# EAGLE design arduino_pir_sensor (EAGLE 6.3)
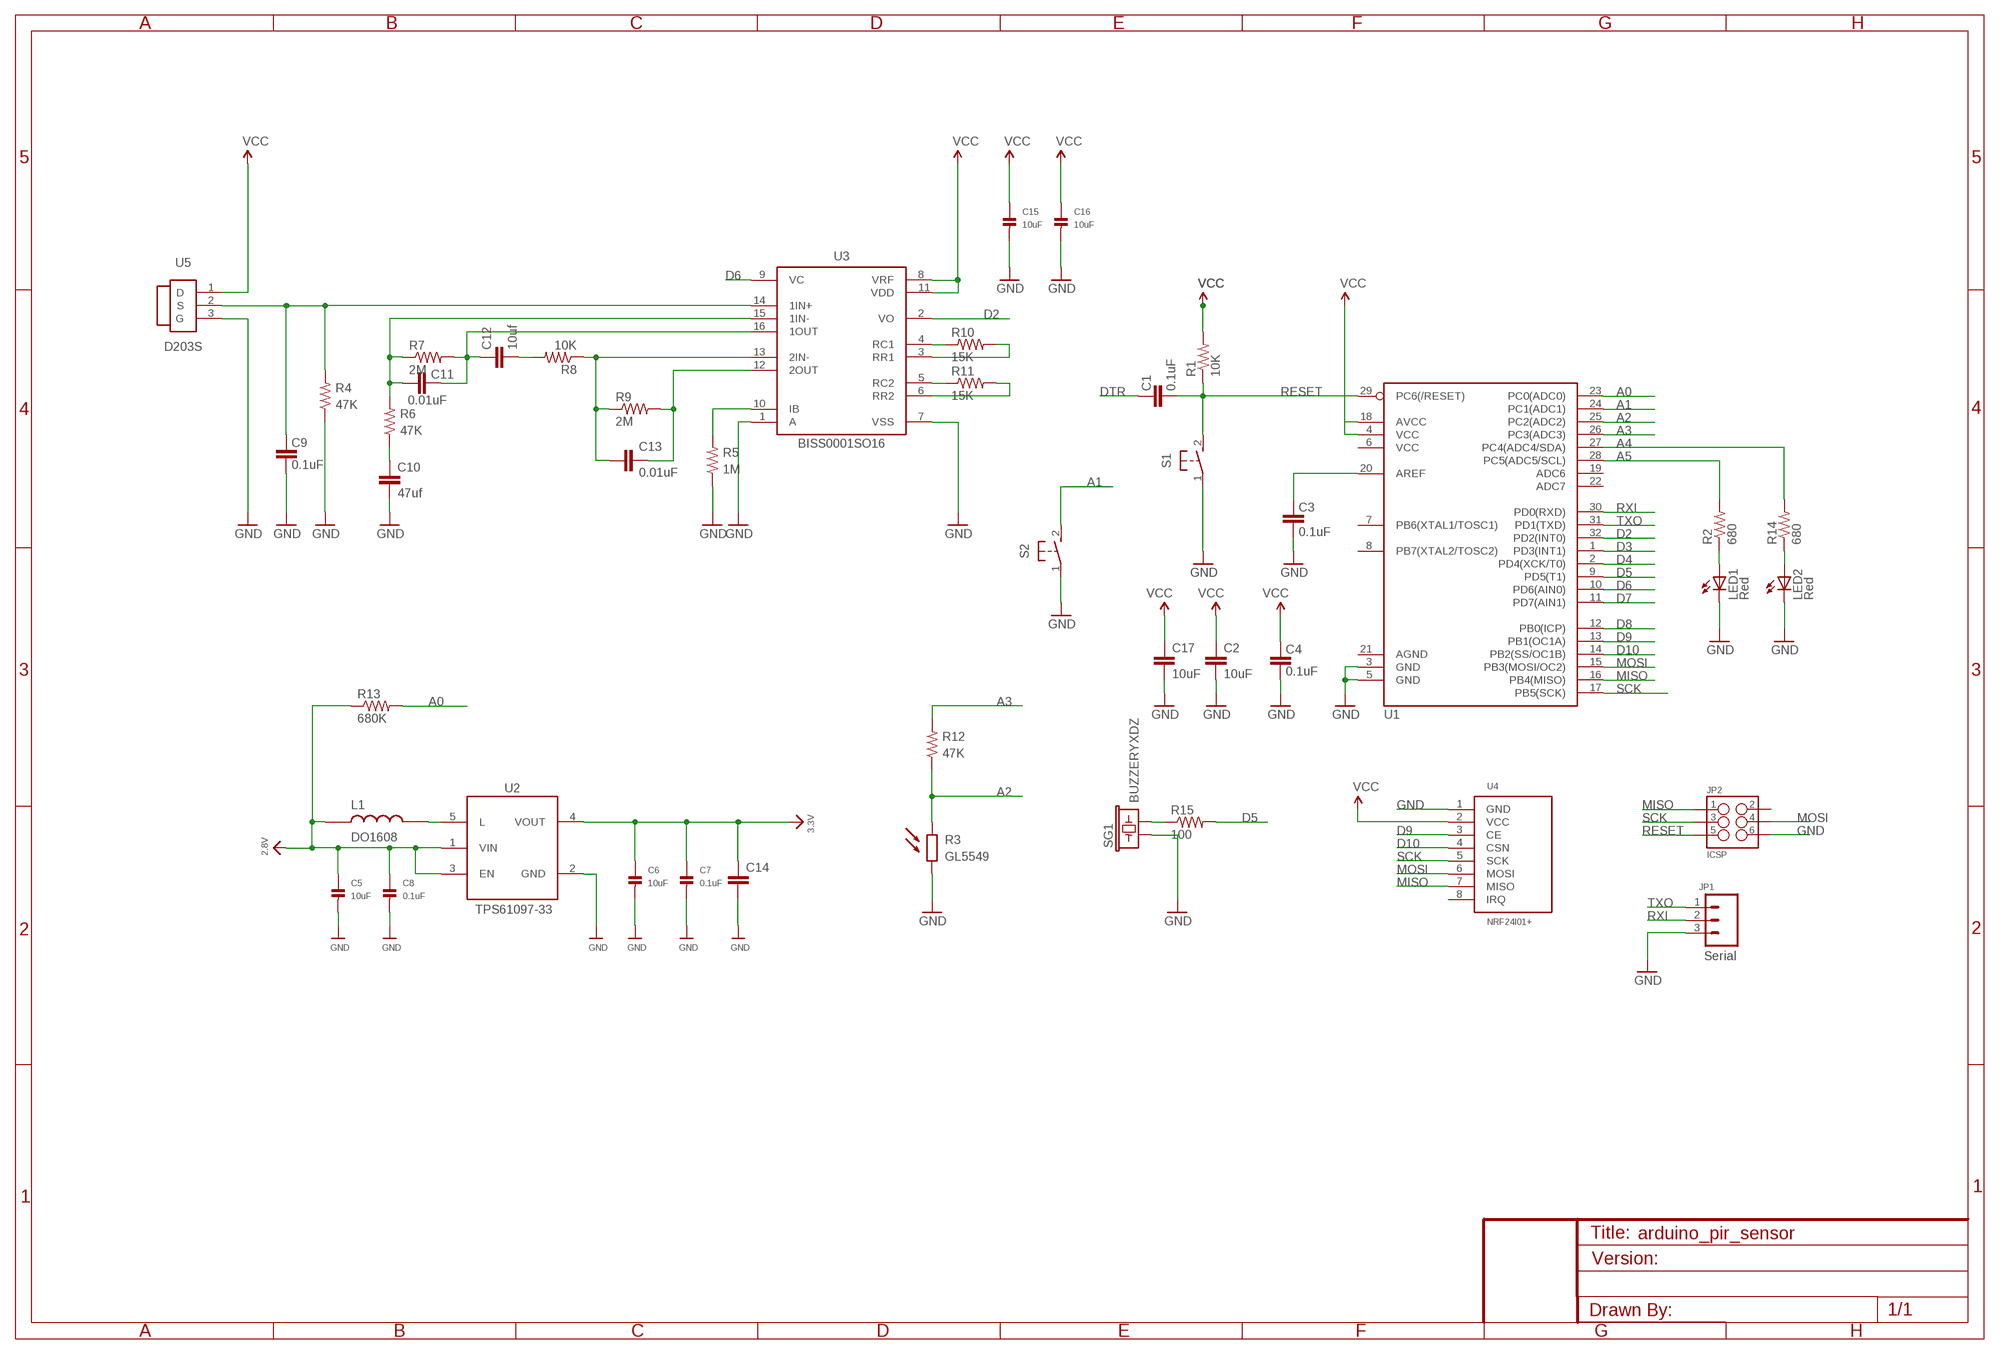
[diagram p0: schematic, sheet 1]

## Parts
C1  0.1uF  CAP0603-CAP  [0603-CAP]
C2  10uF  CAP1206  [1206]
C3  0.1uF  CAP0603-CAP  [0603-CAP]
C4  0.1uF  CAP0603-CAP  [0603-CAP]
C5  10uF  CAP_CERAMIC1206  [1206]
C6  10uF  CAP_CERAMIC1206  [1206]
C7  0.1uF  CAP_CERAMIC0603  [0603]
C8  0.1uF  CAP_CERAMIC0603  [0603]
C9  0.1uF  CAP0603-CAP  [0603-CAP]
C10  47uf  CAP0805  [0805]
C11  0.01uF  CAP0603-CAP  [0603-CAP]
C12  10uf  CAP0805  [0805]
C13  0.01uF  CAP0603-CAP  [0603-CAP]
C14  CAPPTH  [CAP-PTH-SMALL]
C15  10uF  CAP_CERAMIC1206  [1206]
C16  10uF  CAP_CERAMIC1206  [1206]
C17  10uF  CAP1206  [1206]
JP1  Serial  M03PTH  [1X03]
JP2  ICSP  M03X2POGO_PINS  [2X3_POGO]
L1  DO1608  [DO1608]
LED1  Red  LED0603  [LED-0603]
LED2  Red  LED5MM  [LED5MM]
R1  10K  RESISTOR0603-RES  [0603-RES]
R2  680  RESISTOR0603-RES  [0603-RES]
R3  GL5549  [PHOTCELL]
R4  47K  RESISTOR0603-RES  [0603-RES]
R5  1M  RESISTOR0603-RES  [0603-RES]
R6  47K  RESISTOR0603-RES  [0603-RES]
R7  2M  RESISTOR0603-RES  [0603-RES]
R8  10K  RESISTOR0603-RES  [0603-RES]
R9  2M  RESISTOR0603-RES  [0603-RES]
R10  15K  RESISTOR0603-RES  [0603-RES]
R11  15K  RESISTOR0603-RES  [0603-RES]
R12  47K  RESISTOR0603-RES  [0603-RES]
R13  680K  RESISTOR0603-RES  [0603-RES]
R14  680  RESISTOR0603-RES  [0603-RES]
R15  100  RESISTOR0603-RES  [0603-RES]
S1  TAC_SWITCH_SPST-6X3  [TACTILE_SMD_6X3]
S2  TAC_SWITCH_SPST-6X3  [TACTILE_SMD_6X3]
SG1  BUZZERYXDZ  [BUZZER-12MM-7.65]
U1  ATMEGA328_SMT  [TQFP32-08]
U2  TPS61097-33  [SOT-23-5L]
U3  BISS0001SO16  [SO-16]
U4  NRF24L01+_MODULE  [NRF24L01+MODULE]
U5  D203S  [TO5]

## Nets
2.8V: C5.1 C8.1 L1.P$1 R13.1 U2.1(VIN) U2.3(EN)
3.3V: C2.1 C4.2 C6.1 C7.1 C14.1 C15.1 C16.1 C17.1 R1.2 U1.4(VCC) U1.18(AVCC) U2.4(VOUT) U3.8(VRF) U3.11(VDD) U4.2(VCC) U5.1(D) ; supply symbol labelled VCC
A0: R13.2 U1.23(PC0(ADC0))
A1: S2.2 U1.24(PC1(ADC1))
A2: R3.P$1 R12.1 U1.25(PC2(ADC2))
A3: R12.2 U1.26(PC3(ADC3))
A4: R14.2 U1.27(PC4(ADC4/SDA))
A5: R2.2 U1.28(PC5(ADC5/SCL))
D2: U1.32(PD2(INT0)) U3.2(VO)
D3: U1.1(PD3(INT1))
D4: U1.2(PD4(XCK/T0))
D5: R15.2 U1.9(PD5(T1))
D6: U1.10(PD6(AIN0)) U3.9(VC)
D7: U1.11(PD7(AIN1))
D8: U1.12(PB0(ICP))
D9: U1.13(PB1(OC1A)) U4.3(CE)
D10: U1.14(PB2(SS/OC1B)) U4.4(CSN)
DTR: C1.2
GND [vcc]: C2.2 C3.1 C4.1 C5.2 C6.2 C7.2 C8.2 C9.1 C10.2 C14.2 C15.2 C16.2 C17.2 JP1.3 JP2.P$6 LED1.C LED2.K(C) R3.P$2 R4.1 R5.1 S1.1 S2.1 SG1.- U1.3(GND) U1.5(GND) U2.2(GND) U3.1(A) U3.7(VSS) U4.1(GND) U5.3(G)
MISO: JP2.P$1 U1.16(PB4(MISO)) U4.7(MISO)
MOSI: JP2.P$4 U1.15(PB3(MOSI/OC2)) U4.6(MOSI)
N$1: L1.P$2 U2.5(L)
N$2: C9.2 R4.2 U3.14(1IN+) U5.2(S)
N$3: LED1.A R2.1
N$4: C3.2 U1.20(AREF)
N$5: R5.2 U3.10(IB)
N$6: C10.1 R6.1
N$7: C11.2 R6.2 R7.1 U3.15(1IN-)
N$8: C11.1 C12.1 R7.2 U3.16(1OUT)
N$9: C12.2 R8.2
N$10: C13.1 R8.1 R9.1 U3.13(2IN-)
N$11: C13.2 R9.2 U3.12(2OUT)
N$12: R11.1 U3.5(RC2)
N$13: R10.1 U3.4(RC1)
N$14: R10.2 U3.3(RR1)
N$15: R11.2 U3.6(RR2)
N$16: R15.1 SG1.+
N$17: LED2.A R14.1
RESET: C1.1 JP2.P$5 R1.1 S1.2 U1.29(PC6(/RESET))
RXI: JP1.2 U1.30(PD0(RXD))
SCK: JP2.P$3 U1.17(PB5(SCK)) U4.5(SCK)
TXO: JP1.1 U1.31(PD1(TXD))
Unconnected: JP2.P$2 U1.6(VCC) U1.7(PB6(XTAL1/TOSC1)) U1.8(PB7(XTAL2/TOSC2)) U1.19(ADC6) U1.21(AGND) U1.22(ADC7) U4.8(IRQ)

## Library data of the parts
C1 C3 C4 C9 = SparkFun-Capacitors:CAP: Capacitor Standard 0603 ceramic capacitor, and 0.1" leaded capacitor.; MPN: 02016D104KAT2A; OC_NEWARK: 89W0551
C2 C10-C13 C17 = SparkFun-Capacitors:CAP: Capacitor Standard 0603 ceramic capacitor, and 0.1" leaded capacitor.; OC_NEWARK: unknown
C5-C8 C15 C16 = microbuilder:CAP_CERAMIC: Ceramic Capacitors 0402 - 0402 Surface Mount Capacitors 16pF 50V 5% [Digikey: 445-4899-2-ND] 18pF 50V 5% [Digikey: 490-1281-2-ND] 22pF 50V 5% [Digikey: 490-1283-2-ND] 68pF 50V 5% [Digikey: 490-1289-2-ND] 0.1uF 10V 10% [Digikey: 490-1318-2-ND] 1.0uF 6.3V 10% [Digikey: 490-1320-2-ND] 0603 - 0603 Surface Mount Capacitors 16 pF 50V 5% [Digikey: 445-5051-2-ND] 22 pF 50V [Digikey: PCC220ACVTR-ND] 33 pF 50V 5% [Digikey: 490-1415-1-ND] 56pF 50V 5% [Digikey: 490-1421-1-ND] 220pF 50V 5% [Digikey: 445-1285-1-ND] 680 pF 50V 2200 pF 50V 5% C0G [Digikey: 445-1297-1-ND] 5600 pF 100V 5% X7R [Digikey: 478-3711-1-ND] 0.1 µF 25V 10% [Digikey: PCC2277TR-ND] 0.22 µF 16V 10% X7R [Digikey: 445-1318-1-ND] 1.0 µF 25V 10% [Digikey: 445-5146-2-ND] 0603 - RF Specific 3pF 250V +/-0.1pF RF [Digikey: 712-1347-1-ND] 18 pF 250V 5% [Digikey: 478-3505-1-ND or 712-1322-1-ND] 56 pF 250V 5% C0G RF [Digikey: 490-4867-1-ND] 68 pF 250V RF [Digikey: 490-4868-1-ND] 0805 - 0805 Surface Mount Capacitors 220 pF 250V 2% RF Ceramic Capacitor [Digikey: 712-1398-1-ND] 1000 pF 50V 2% NP0 Ceramic Capacitor [Digikey: 478-3760-1-ND] 0.1 µF 25V 10% Ceramic Capacitor [Digikey: PCC1828TR-ND] 1.0 µF 16V 10% Ceramic Capacitor[Digikey: 490-1691-2-ND] 10.0 µF 10V 10% Ceramic Capacitor[Digikey: 709-1228-1-ND] 10.0 uF 16V 10% Ceramic Capacitor [Digikey: 478-5165-2-ND] 47 uF 6.3V 20% Ceramic Capacitor [Digikey: 587-1779-1-ND or 399-5506-1-ND] 1206 - 1206 Surface Mount Capacitors 47uF 10V 20% Ceramic Capacitor [Digikey: 490-5528-1-ND or 399-5508-1-ND or 445-6010-1-ND] 100uF 6.3V -20%, +80% Y5V Ceramic Capacitor (Digikey: 490-4512-1-ND, Mouser: 81-GRM31CF50J107ZE1L); OC_NEWARK: unknown
C14 = SparkFun-Capacitors:CAP: Capacitor Standard 0603 ceramic capacitor, and 0.1" leaded capacitor.
JP1 = endy-connectors:M03: Header 3 Standard 3-pin 0.1" header. Use with straight break away headers (SKU : PRT-00116), right angle break away headers (PRT-00553), swiss pins (PRT-00743), machine pins (PRT-00117), and female headers (PRT-00115). Molex polarized connector foot print use with SKU : PRT-08232 with associated crimp pins and housings.
JP2 = endy-connectors:M03X2: 2x3 .1" header. Shrouded, with keying- CONN-10681 SMT- CONN-11415 Pogo pins- HW-11044; OC_NEWARK: unknown; PROD_ID: HW-11044
L1 = inductors:DO1608: SMD power inductor; OC_NEWARK: unknown
LED1 = SparkFun-LED:LED: LEDs Standard schematic elements and footprints for 5mm, 3mm, 1206, and 0603 sized LEDs. 5mm - Spark Fun Electronics SKU : COM-00529 (and others); OC_NEWARK: unknown
LED2 = led:LED: LED OSRAM: - CHIPLED LG R971, LG N971, LY N971, LG Q971, LY Q971, LO R971, LY R971 LH N974, LH R974 LS Q976, LO Q976, LY Q976 LO Q996 - Hyper CHIPLED LW Q18S LB Q993, LB Q99A, LB R99A - SideLED LS A670, LO A670, LY A670, LG A670, LP A670 LB A673, LV A673, LT A673, LW A673 LH A674 LY A675 LS A676, LA A676, LO A676, LY A676, LW A676 LS A679, LY A679, LG A679 - Hyper Micro SIDELED® LS Y876, LA Y876, LO Y876, LY Y876 LT Y87S - SmartLED LW L88C, LW L88S LB L89C, LB L89S, LG L890 LS L89K, LO L89K, LY L89K LS L896, LA L896, LO L896, LY L896 - TOPLED LS T670, LO T670, LY T670, LG T670, LP T670 LSG T670, LSP T670, LSY T670, LOP T670, LYG T670 LG T671, LOG T671, LSG T671 LB T673, LV T673, LT T673, LW T673 LH T674 LS T676, LA T676, LO T676, LY T676, LB T676, LH T676, LSB T676, LW T676 LB T67C, LV T67C, LT T67C, LS T67K, LO T67K, LY T67K, LW E67C LS E67B, LA E67B, LO E67B, LY E67B, LB E67C, LV E67C, LT E67C LW T67C LS T679, LY T679, LG T679 LS T770, LO T770, LY T770, LG T770, LP T770 LB T773, LV T773, LT T773, LW T773 LH T774 LS E675, LA E675, LY E675, LS T675 LS T776, LA T776, LO T776, LY T776, LB T776 LHGB T686 LT T68C, LB T68C - Hyper Mini TOPLED® LB M676 - Mini TOPLED Santana® LG M470 LS M47K, LO M47K, LY M47K Source: http://www.osram.convergy.de LUXEON: - LUMILED® LXK2-PW12-R00, LXK2-PW12-S00, LXK2-PW14-U00, LXK2-PW14-V00 LXK2-PM12-R00, LXK2-PM12-S00, LXK2-PM14-U00 LXK2-PE12-Q00, LXK2-PE12-R00, LXK2-PE12-S00, LXK2-PE14-T00, LXK2-PE14-U00 LXK2-PB12-K00, LXK2-PB12-L00, LXK2-PB12-M00, LXK2-PB14-N00, LXK2-PB14-P00, LXK2-PB14-Q00 LXK2-PR12-L00, LXK2-PR12-M00, LXK2-PR14-Q00, LXK2-PR14-R00 LXK2-PD12-Q00, LXK2-PD12-R00, LXK2-PD12-S00 LXK2-PH12-R00, LXK2-PH12-S00 LXK2-PL12-P00, LXK2-PL12-Q00, LXK2-PL12-R00 Source: www.luxeon.com KINGBRIGHT: KA-3528ASYC Source: www.kingbright.com; OC_NEWARK: unknown
R1 R2 R4-R15 = SparkFun-Resistors:RESISTOR: Resistor Basic schematic elements and footprints for 0603, 1206, and PTH resistors.; OC_NEWARK: unknown
R3 = opto:GL5549: Cds PHOTOCONDUCTIOVE CELL; OC_NEWARK: unknown
S1 S2 = buttons:TAC_SWITCH_SPST; OC_NEWARK: unknown
SG1 = endy-electromechanical:BUZZER: Buzzer 12mm Spark Fun Electronics SKU : Comp-Buzzer; OC_NEWARK: unknown
U1 = SparkFun-DigitalIC:ATMEGA328_SMT: 32-Pin Atmega328 part Commonly used on Arduino compatible boards Available in QFP and QFN packages TQFP is IC-09069 QFN is non-stock; OC_NEWARK: unknown; PROD_ID: IC-09069; VALUE: ATMEGA328P
U2 = DC-DC:TPS61097-33: Description The TPS61097 provide a power supply solution for products powered by either a single-cell, two-cell, or three-cell alkaline, NiCd, or NiMH, or one-cell Li-Ion or Li-polymer battery. They can also be used in fuel cell or solar cell powered devices where the capability of handling low input voltages is essential. Possible output currents depend on the input-to-output voltage ratio. The devices provides output currents up to 100 mA at a 3.3-V output while using a single-cell Li-Ion or Li-Polymer battery. The boost converter is based on a current-mode controller using synchronous rectification to obtain maximum efficiency. The maximum average input current is limited to a value of 350 mA. The output voltage can be programmed by an external resistor divider, or it is fixed internally on the chip. The converter can be disabled to minimize battery drain. During shutdown, the battery is connected to the load to enable battery backup of critical functions on the load. The fixed output device is packaged in a 5-pin SOT-23 package (DBV) measuring 2.8 mm × 2.9 mm. Features Up to 95% Efficiency at Typical Operating Conditions Connection from Battery to Load via Bypass Switch in Shutdown Mode Typical Shutdown Current Less Than 5 nA Typical Quiescent Current Less Than 5 µA Operating Input Voltage Range From 0.9 V to 5.5 V Power-Save Mode for Improved Efficiency at Low Output Power Overtemperature Protection Small 2.8-mm × 2.9-mm 5-Pin SOT-23 Package (6-Pin for Adjustable) Applications MSP430 Applications All Single-Cell, Two-Cell, and Three-Cell Alkaline, NiCd, NiMH, or Single-Cell Li-Battery Powered Products Personal Medical Products Fuel Cell and Solar Cell Powered Products PDAs Mobile Applications White LEDs Source http://www.ti.com/lit/ds/symlink/tps61040.pdf; OC_NEWARK: unknown
U3 = ic:BISS0001: Features Low power CMOS technology (ideal for battery operated PIR devices) CMOS high input impedance operational amplifiers Bi-directional level detector / Excellent noise immunity Built-in Power up disable & output pulse control logic Dual mode : retriggerable & non-retriggerable Source Datasheet <http://learn.adafruit.com/system/assets/assets/000/010/133/original/BISS0001.pdf>; OC_NEWARK: unknown
U4 = modules:NRF24L01+_MODULE
U5 = opto:D203S: The pyroelectric infrared sensor The pyroelectric infrared sensor detects infrared radiation on the basis of the characteristics that the polarization of pyroelectric material changes with temperature. Dual compensated sensing elements are applied to suppress the interference resulting from temperature variation. As a result, the operating stability of the sensor is greatly improved. Our products can be used in many applications. Such as in security systems, burglar alarms, visitor acknowledgement, light switch control and intellectualized toy, etc.; OC_NEWARK: unknown

## Net classes
1 vcc: width 0.254 mm

## Board
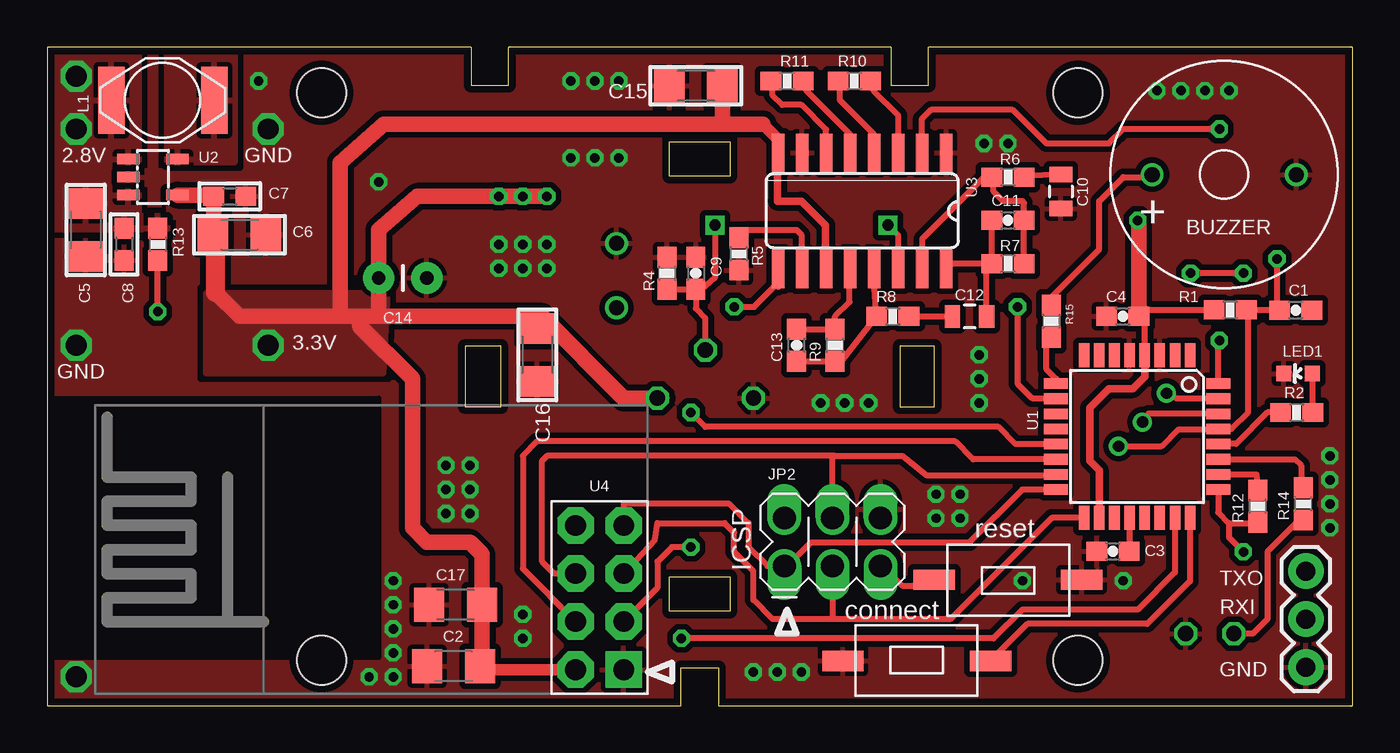
[diagram p1: board, top side]
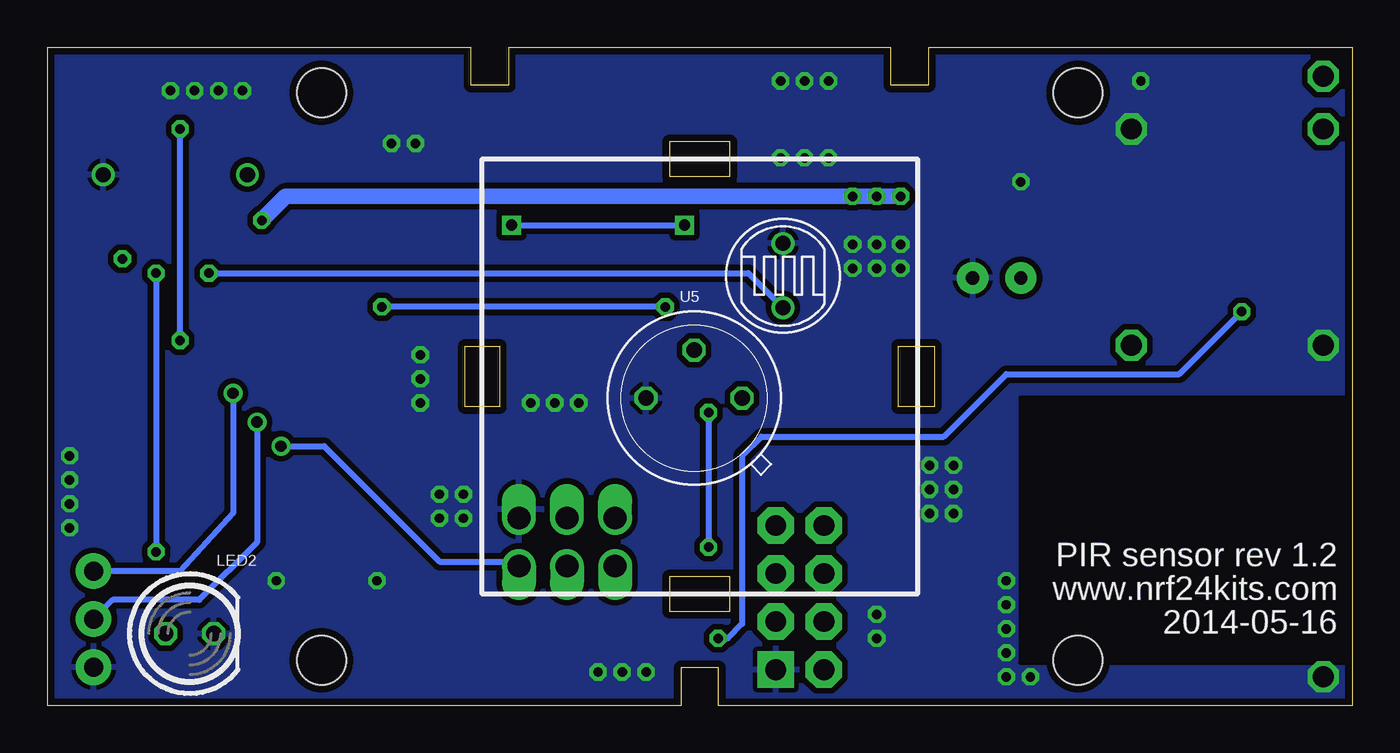
[diagram p2: board, bottom side, seen from below]

Size 69 x 34.8 mm. Coordinates in mm from the lower left corner, seen from the top.
Outline: 0,0 33.5,0 33.5,2 35.5,2 35.5,0 69,0 69,34.8 46.6,34.8 46.6,32.8 44.6,32.8 44.6,34.8 24.4,34.8 24.4,32.8 22.4,32.8 22.4,34.8 0,34.8 0,0
Outline: 32.9,4.98 32.9,6.82 36.1,6.82 36.1,4.98 32.9,4.98
Outline: 32.9,27.98 32.9,29.82 36.1,29.82 36.1,27.98 32.9,27.98
Outline: 22.08,15.8 24,15.8 24,19 22.08,19 22.08,15.8
Outline: 45.08,15.8 46.92,15.8 46.92,19 45.08,19 45.08,15.8
Copper layers (1*16): Top 0.035mm / dielectric 1.5mm / Bottom 0.035mm
Design rules "default *": minimum track width 10mil, minimum drill 10mil, track to track 12mil, track to pad 10mil, pad to pad 6mil, via to via 6mil, smd to smd 6mil, copper to edge 15mil, drill to drill 8mil, minimum pad ring 8mil, minimum via ring 8mil, stop-mask expansion 4mil, vias tented up to drill 20mil, thermal gap 10mil
Holes 2.6 mm at 14.5,2.4 14.5,32.4 54.5,2.4 54.5,32.4
tRestrict: area 0,2.5 to 17.5,16.3
bRestrict: area 0,2.3 to 17.5,16.3

### Footprints (pad centres in the part's own frame; a part is rotated, then mirrored left to right if it is on the bottom)
0603-CAP = smd 1.1 x 1: 1 -0.85,0; 2 0.85,0
1206 = smd 1.6 x 1.8: 1 -1.4,0; 2 1.4,0
0603 = smd 1.1 x 1: 1 -0.85,0; 2 0.85,0
0805 = smd 0.8 x 1.2: 1 -0.9,0; 2 0.9,0
CAP-PTH-SMALL = drill 0.7 pad 1.651: 1 0,0; 2 2.54,0
1X03 = drill 1.016 pad 1.88: 1 0,0; 2 2.54,0; 3 5.08,0
2X3_POGO = drill 1.2 pad 1.575 offset: P$1 0,0; P$2 0,2.54; P$3 2.54,0; P$4 2.54,2.54; P$5 5.08,0; P$6 5.08,2.54
DO1608 = smd 1.4 x 3.56: P$1 -2.71,0; P$2 2.74,0
LED-0603 = smd 0.8 x 0.8: A 0,-0.75; C 0,0.75
LED5MM = drill 0.813 octagon: A -1.27,0; K 1.27,0
0603-RES = smd 1.1 x 1: 1 -0.85,0; 2 0.85,0
PHOTCELL = drill 0.8: P$1 0,-1.7; P$2 0,1.7
TACTILE_SMD_6X3 = smd 2.184 x 1.067: 1 -3.9,-0.05; 2 3.9,-0.05
BUZZER-12MM-7.65 = drill 0.8: + 3.81,0; - -3.81,0
TQFP32-08 = smd 1.27 x 0.559: 1 -4.293,2.8; 2 -4.293,2; 3 -4.293,1.2; 4 -4.293,0.4; 5 -4.293,-0.4; 6 -4.293,-1.2; 7 -4.293,-2; 8 -4.293,-2.8; 17 4.293,-2.8; 18 4.293,-2; 19 4.293,-1.2; 20 4.293,-0.4; 21 4.293,0.4; 22 4.293,1.2; 23 4.293,2; 24 4.293,2.8 | smd 0.559 x 1.27: 9 -2.8,-4.293; 10 -2,-4.293; 11 -1.2,-4.293; 12 -0.4,-4.293; 13 0.4,-4.293; 14 1.2,-4.293; 15 2,-4.293; 16 2.8,-4.293; 25 2.8,4.293; 26 2,4.293; 27 1.2,4.293; 28 0.4,4.293; 29 -0.4,4.293; 30 -1.2,4.293; 31 -2,4.293; 32 -2.8,4.293
SOT-23-5L = smd 0.55 x 1.2: 1 -0.95,-1.3; 2 0,-1.3; 3 0.95,-1.3; 4 0.95,1.3; 5 -0.95,1.3
SO-16 = smd 0.66 x 2.032: 1 -4.445,-3.073; 2 -3.175,-3.073; 3 -1.905,-3.073; 4 -0.635,-3.073; 5 0.635,-3.073; 6 1.905,-3.073; 7 3.175,-3.073; 8 4.445,-3.073; 9 4.445,3.073; 10 3.175,3.073; 11 1.905,3.073; 12 0.635,3.073; 13 -0.635,3.073; 14 -1.905,3.073; 15 -3.175,3.073; 16 -4.445,3.073
NRF24L01+MODULE = drill 1.1 pad 1.93 square: 1 -1.27,3.81 | drill 1.1 pad 1.93 octagon: 2 1.27,3.81; 3 -1.27,1.27; 4 1.27,1.27; 5 -1.27,-1.27; 6 1.27,-1.27; 7 -1.27,-3.81; 8 1.27,-3.81
TO5 = drill 0.813 octagon: 1 0,-2.54; 2 2.54,0; 3 0,2.54

### Placement (x,y rotation side)
C1  66.01,20.91 0 top
C2  21.48,2.08 180 top
C3  56.35,8.16 0 top
C4  56.86,20.58 0 top
C5  2.03,25.15 270 top
C6  10.16,24.89 0 top
C7  9.65,26.92 0 top
C8  4.06,24.38 270 top
C9  34.29,22.86 270 top
C10  53.59,27.18 270 top
C11  50.8,25.65 0 top
C12  48.77,20.57 180 top
C13  39.62,19.05 90 top
C14  17.53,22.61 0 top
C15  34.29,32.77 180 top
C16  25.91,18.54 270 top
C17  21.59,5.33 180 top
JP1  66.55,7.11 270 top
JP2  38.98,7.39 0 top
L1  6.1,32 0 top
LED1  66.14,17.56 90 top
LED2  61.47,3.81 0 bottom
R1  62.55,20.92 180 top
R2  66.06,15.5 180 top
R3  30.1,22.73 0 bottom
R4  32.77,22.86 270 top
R5  36.58,23.88 90 top
R6  50.8,27.94 180 top
R7  50.8,23.37 180 top
R8  44.7,20.57 0 top
R9  41.66,19.05 90 top
R10  42.67,33.02 0 top
R11  39.12,33.02 180 top
R12  64.01,10.54 90 top
R13  5.84,24.38 270 top
R14  66.42,10.67 90 top
R15  53.09,20.32 270 top
S1  50.8,6.6 180 top
S2  45.97,2.41 0 top
SG1  62.23,28.07 180 top
U1  57.62,14.22 270 top
U2  5.59,27.94 270 top
U3  43.09,26.15 180 top
U4  29.21,5.71 180 top
U5  34.8,16.26 90 bottom

### Tracks (layer width: path | path; a pad name or v marks a point on that pad's centre or on a via)
2.8V  (via drill 1.1)
  Top 0.305: 4.35,28.96 U2.1
  other vias: 1.52,33.27 1.52,30.48
  pour Top: 0,34.8 4.83,34.8 4.83,28.7 3.3,28.7 3.3,27.18 4.83,27.18 4.83,25.91 6.35,25.91 6.35,25.15 0,25.15
3.3V  (via drill 0.5, 1.1)
  Top 0.305: U1.4 58.02,20.92 | C4.2 58.02,21.08 58.02,20.92 | 58.02,20.92 R1.2 | 8.89,25.02 C6.1 | U3.8 38.65,29.93 | 57.71,25.6 v57.66,25.65 | U5.1 32.77,16.26 | C16.1 25.91,20.57
  Top 0.406: U1.18 55.63,12.45 55.12,12.95 55.12,15.75 56.13,16.76 57.4,16.76 58.04,17.4 58.04,18.53 U1.4 | U3.8 38.61,29.23 38.61,26.67 39.88,26.67 41.15,25.4 41.15,23.12 U3.11
  Top 0.61: 38.65,29.93 37.85,30.73 | C2.1 23.06,1.91 U4.2 23.5,1.91 23.11,2.29
  Top 0.813: U5.1 30.48,16.26 26.16,20.57 25.91,20.57 17.53,20.57 | 17.53,20.57 17.27,20.57 | 16.51,20.57 17.27,20.57 | 37.85,30.73 35.56,30.73 | C4.2 57.71,25.6 | U2.4 8.74,26.99 C7.1 8.8,25.1 C6.1 | v26.42,26.92 v23.88,26.92 19.56,26.92 17.53,25.15 17.53,20.57 | 35.56,30.73 17.78,30.73 15.49,28.7 15.49,20.57 | 16.51,20.57 15.49,20.57 | C14.1 17.53,20.83 17.27,20.57 | 8.89,21.84 10.16,20.57 15.49,20.57 | C15.1 35.69,30.86 35.56,30.73 | 16.51,20.57 16.51,20.07 19.3,17.27 19.3,9.4 20.07,8.64 22.35,8.64 22.99,8 C17.1 22.99,2.19 C2.1
  Top 1.016: 8.89,25.02 8.89,21.84
  Bottom 0.813: v23.88,26.92 v25.15,26.92 56.39,26.92 v57.66,25.65
  other vias: 11.68,19.05
  pour Top: 8.38,21.84 18.03,21.84 17.78,17.53 8.38,17.53
A0  (via drill 0.5)
  Top 0.305: v5.84,20.83 R13.2 | U1.23 59.62,7.04 57.66,5.08 51.56,5.08 50.04,3.56 v33.53,3.56
  Bottom 0.305: v33.53,3.56 33.02,3.56 32.26,4.32 32.26,13.21 31.24,14.22 21.59,14.22 18.29,17.53 9.14,17.53 v5.84,20.83
A1
  Top 0.305: U1.24 60.42,6.58 58.17,4.32 51.83,4.32 S2.2
A2  (via drill 0.5)
  Top 0.305: v63.25,22.86 v60.45,22.86 | U1.25 61.92,10.22 62.48,9.65 | 62.48,9.65 63.97,9.65 R12.1 | 62.48,9.65 62.48,8.89 v63.25,8.13
  Bottom 0.305: v63.25,22.86 v63.25,8.13 | v60.45,22.86 31.93,22.86 R3.P$1
A3
  Top 0.305: U1.26 63.94,12.22 R12.2
A4
  Top 0.305: U1.27 65.97,13.03 66.29,12.7 66.29,11.64 R14.2
A5
  Top 0.305: R2.2 64.52,15.5 62.87,13.84 61.93,13.84 U1.28
D2  (via drill 0.5)
  Top 0.305: U1.32 61.92,19.24 v61.98,19.3 | v61.98,30.48 56.9,30.48 56.13,29.72 52.83,29.72 51.05,31.5 46.74,31.5 46.23,30.99 46.23,29.26 U3.2
  Bottom 0.305: v61.98,19.3 v61.98,30.48
D5
  Top 0.305: U1.9 53.33,17.28 52.83,17.78 52.83,19.22 R15.2
D6  (via drill 0.5)
  Top 0.305: U3.9 38.65,22.35 | 38.65,22.35 38.65,22.14 | v51.31,21.08 51.31,17.02 52.07,16.26 53.3,16.26 U1.10 | v36.32,21.08 37.38,21.08 38.65,22.35
  Bottom 0.305: v36.32,21.08 v51.31,21.08
D9  (via drill 0.5)
  Top 0.305: U1.13 51.2,13.82 50.29,14.73 34.8,14.73 v34.04,15.49 | v34.04,8.38 33.02,8.38 32.26,7.62 32.26,6.22 U4.3
  Bottom 0.305: v34.04,15.49 v34.04,8.38
D10
  Top 0.305: U1.14 48.95,13.03 48.01,13.97 25.91,13.97 25.15,13.21 25.15,7.24 U4.4
GND  (via drill 0.5, 1.1)
  other vias: 11.18,33.02 27.69,28.96 28.96,28.96 30.23,28.96 49.53,29.72 17.53,27.69 40.89,16 21.08,12.7 21.08,11.43 22.35,11.43 22.35,12.7 21.08,10.16 22.35,10.16 39.88,1.78 38.61,1.78 37.34,1.78 25.15,3.56 25.15,4.83 58.67,32.51 59.94,32.51 61.21,32.51 62.48,32.51 27.69,33.02 28.96,33.02 30.23,33.02 67.82,10.67 56.9,6.6 46.99,11.18 48.26,11.18 48.26,9.91 46.99,9.91 49.28,18.54 49.28,17.27 49.28,16 18.29,1.52 17.02,1.52 18.29,6.6 18.29,4.06 18.29,2.79 1.52,1.52 51.56,6.6 23.88,24.38 25.15,24.38 26.42,24.38 26.42,23.11 25.15,23.11 23.88,23.11 43.43,16 42.16,16 50.8,29.72 18.29,5.33 67.82,11.94 67.82,13.21 67.82,9.4 1.52,19.05 11.68,30.48
  pour Top (rank 6): 0,34.8 68.83,34.8 68.83,0 0,0
  pour Bottom: 0,34.8 69.09,34.8 69.09,0 0,0
MISO
  Top 0.305: 53.34,11.41 U1.16 51.56,11.43 48.77,8.64 40.39,8.64 39.14,7.39 JP2.P$1 38.08,7.39 37.08,8.38 37.08,9.65 36.07,10.67 30.48,10.67 U4.7
MOSI
  Top 0.305: JP2.P$4 41.52,13.07 41.66,13.21 | U1.15 53.3,12.19 46.48,12.19 45.21,13.21 41.66,13.21 | 41.66,13.21 26.42,13.21 26.16,12.95 26.16,7.62 26.8,6.99 U4.6
N$1
  pour Top: 6.35,34.8 9.91,34.8 9.91,28.7 6.35,28.7
N$2  (via drill 0.6)
  Top 0.305: U5.2 34.8,20.49 34.29,20.99 C9.2 R4.2 34.63,22.01 35.31,22.61 v35.31,25.4 | U3.14 44.99,24.86 v44.45,25.4
  Bottom 0.305: v44.45,25.4 v35.31,25.4
N$3
  Top 0.305: LED1.A 66.89,15.52 R2.1
N$4
  Top 0.305: U1.20 57.22,7.97 C3.2
N$5
  Top 0.305: R5.2 36.66,24.73 37.08,25.15 39.62,25.15 39.88,24.89 39.88,23.12 U3.10
N$6
  Top 0.305: C10.1 51.7,27.99 R6.1
N$7
  Top 0.305: U3.15 46.27,24.68 49.53,27.94 R6.2 50.04,27.85 50.04,27.18 50.55,26.67 51.56,26.67 51.65,26.58 C11.2 R7.1
N$8
  Top 0.305: R7.2 C11.1 | C12.1 49.67,23.09 R7.2 | R7.2 47.82,23.37 U3.16
N$9
  Top 0.305: R8.2 C12.2
N$10
  Top 0.305: C13.1 R9.1 41.99,18.2 R8.1 43.69,22.79 U3.13
N$11
  Top 0.305: C13.2 R9.2 41.66,20.57 42.42,21.34 42.42,22.79 U3.12
N$12
  Top 0.305: U3.5 42.45,30.19 40.13,32.51 40.13,32.93 R11.1
N$13
  Top 0.305: 42.16,32.68 R10.1 41.91,32.93 41.91,32 43.69,30.23 43.69,29.01 U3.4
N$14
  Top 0.305: U3.3 44.99,31.2 43.69,32.51 43.69,32.85 R10.2
N$15
  Top 0.305: U3.6 41.19,30.44 39.88,31.75 38.86,31.75 38.35,32.26 38.35,32.85 R11.2
N$16
  Top 0.305: R15.1 53.09,21.59 55.63,24.13 55.63,26.67 56.9,27.94 58.29,27.94 SG1.+
N$17
  Top 0.305: R14.1 66.21,9.82 64.52,8.13 64.52,4.57 63.75,3.81 LED2.A
RESET  (via drill 0.5, 0.6)
  Top 0.305: C1.1 R1.1 63.5,20.82 63.5,15.49 62.63,14.62 U1.29 61.9,14.61 59.82,14.61 58.93,13.72 v56.64,13.72 | 65.28,20.79 C1.1 | JP2.P$5 44.18,7.39 45.21,6.35 46.6,6.35 S1.2 | v65.02,23.62 65.02,21.04 C1.1
  Bottom 0.305: v56.64,13.72 54.36,13.72 48.26,7.62 44.29,7.62 JP2.P$5
RXI  (via drill 0.6)
  Top 0.305: U1.30 58.23,15.44 v57.91,14.99
  Bottom 0.305: v57.91,14.99 57.91,8.64 60.96,5.59 65.53,5.59 JP1.2
SCK
  Top 0.305: 54.86,9.89 U1.17 53.11,9.93 47.75,4.57 41.4,4.57 | U4.5 32.13,8.76 32.26,9.65 35.81,9.65 36.32,9.14 36.32,8.13 37.34,7.11 37.34,5.59 38.35,4.57 41.4,4.57 | JP2.P$3 41.52,4.69 41.4,4.57
TXO  (via drill 0.6)
  Top 0.305: U1.31 59.72,16.23 v59.18,16.51
  Bottom 0.305: v59.18,16.51 59.18,10.16 61.98,7.11 JP1.1

### Text on the board
tPlace: 2.8V | GND | BUZZER | 3.3V | GND | reset | TXO | connect | RXI | GND
bPlace: PIR sensor rev 1.2 | www.nrf24kits.com | 2014-05-16